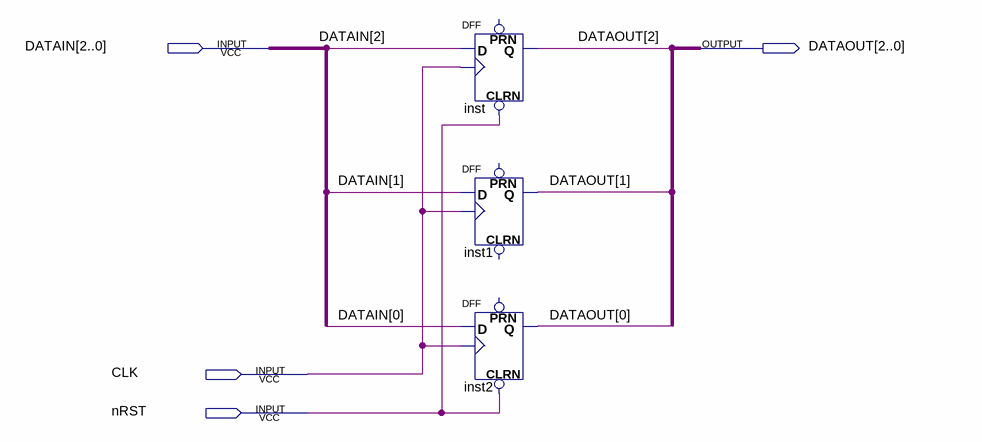
[diagram p0: schematic sheet]
// Quartus schematic REGISTRO3BITS.bdf as structural Verilog: 3 symbols, 4 pins
module REGISTRO3BITS (
  input  [2:0] DATAIN,
  input  CLK,
  input  nRST,
  output [2:0] DATAOUT
);

  DFF inst (.CLRN(nRST), .CLK(CLK), .D(DATAIN[2]), .Q(DATAOUT[2]));  // open: PRN
  DFF inst1 (.CLK(CLK), .D(DATAIN[1]), .Q(DATAOUT[1]));  // open: CLRN, PRN
  DFF inst2 (.CLRN(nRST), .CLK(CLK), .D(DATAIN[0]), .Q(DATAOUT[0]));  // open: PRN
endmodule
